# Altium schematic sheet FLASH_BLE.SchDoc
size A; SheetNumber: 4; SheetTotal: 8
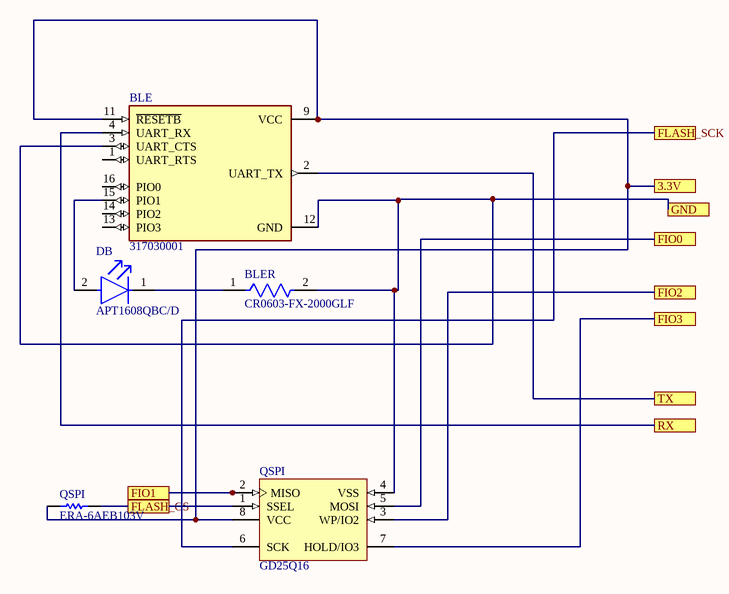
[diagram p0: FLASH_BLE.SchDoc]

## Parts
(Parts that share a designator on the sheet are numbered #1, #2 ... from top to bottom, then left to right.)
BLE  317030001  [XCVR_317030001]
BLER  CR0603-FX-2000GLF  [FP-CR0603-IPC_C]
DB  APT1608QBC/D  [FP-APT1608QBC-D-MFG]
QSPI#1  GD25Q16  [MICT-MN-8_N]
QSPI#2  ERA-6AEB103V  [RESC2013X60X40LL20T25_A]

## Ports
3.3V, FIO0, FIO1, FIO2, FIO3, FLASH_CS, FLASH_SCK, GND, RX, TX

## Nets
3.3V: BLE.9(VCC) BLE.11(~{RESETB}) QSPI#1.8(VCC) QSPI#2.1 ; port 3.3V
FIO0: QSPI#1.5(MOSI) ; port FIO0
FIO1: QSPI#1.2(MISO) ; port FIO1
FIO2: QSPI#1.3(WP/IO2) ; port FIO2
FIO3: QSPI#1.7(HOLD/IO3) ; port FIO3
FLASH_CS: QSPI#1.1(SSEL) QSPI#2.2 ; port FLASH_CS
FLASH_SCK: QSPI#1.6(SCK) ; port FLASH_SCK
GND: BLE.3(UART_CTS) BLE.12(GND) BLER.2 QSPI#1.4(VSS) ; port GND
RX: BLE.4(UART_RX) ; port RX
TX: BLE.2(UART_TX) ; port TX
NetBLE_15: BLE.15(PIO1) DB.2(A)
NetBLER_1: BLER.1 DB.1(C)

Not connected (* = marked no-connect by the designer): BLE 1(UART_RTS) 13(PIO3) 14(PIO2) 16(PIO0)

## Library data of the parts
BLE = 317030001: Bluetooth Bluetooth v4.0 Transceiver Module 2.4GHz Integrated, Trace Surface Mount; MF: Seeed Technology; Value: *; SnapEDA_Link: https://www.snapeda.com/parts/317030001/Seeed%20Technology%20Co.%2C%20Ltd/view-part/449174/?ref=snap; Digi-Key_Purchase_URL: https://www.digikey.kr/product-detail/en/seeed-technology-co-ltd/317030001/1597-1359-ND/5487659?utm_source=snapeda&utm_medium=aggregator&utm_campaign=symbol; MP: 317030001; Digi-Key_Part_Number: 1597-1359-ND; Package: Module Seeed Technology
BLER = CMP-07231-003229-1: Thick Film Chip Resistors 0603 200Ω 0.1W 1% 100ppm/°C; Voltage Rating: 50V; Max Power Dissipation: 100mW; Resistance: 200R; Termination: SMD/SMT; Features: Moisture Resistant; Min Operating Temperature: -55°C; Height: 0.022inch; Depth: 0.8mm; Number of Terminations: 2; Packaging: Tape and Reel; Mount: Surface Mount; Width: 0.8mm; Case/Package: 0603; Max Operating Temperature: 155°C; Composition: Thick Film; Contact Plating: Tin; Length: 1.6mm; Tolerance: 1%; Military Standard: Not; Case Code (Imperial): 0603; Temperature Coefficient: 100ppm/°C; Power Rating: 100mW; Radiation Hardening: No; Case Code (Metric): 1608; Thickness: 457um; Package Quantity: 10000
DB = CMP-2000-05788-2: LED BLUE CLEAR CHIP SMD; Lens Style: Flat; Forward Current: 20mA; Luminous Intensity: 100mcd; Number of LEDs: 1; Dominant Wavelength: 465nm; Lens Color: Colorless; Forward Voltage: 3.3V; Viewing Angle: 120°; Case Code (Imperial): 0603; Number of Pins: 2; Length: 1.6mm; Mount: Surface Mount; Color: Blue; Width: 0.8mm; Height: 0.75mm; Case/Package: 0603; Lead Free: Lead Free; Case Code (Metric): 1608; Lens Transparency: Clear; Min Operating Temperature: -40°C; Packaging: Tape and Reel; Max Operating Temperature: 85°C; Package Quantity: 2000; Test Current: 20mA; Illumination Color: Blue
QSPI#1 = CMP-0357-00068-1: 1 Mb (x1) Serial NOR Flash Memory with Page Erase, 75 MHz, 2.7 to 3.6 V, 8-pin SO8 Narrow (MN), Tube; Part Family: M45PE; Manufacturer: Micron; PartNumber: M45PE10-VMN6P; Speed: 75 MHz; Voltage: 2.7V-3.6V; Density: 1Mb; PackageReference: MICT-MN-8; PackageDescription: 8-Pin SO Narrow, 3.9 X 4.9 mm, Pitch 1.27 mm; Part Status: Production; Mounting Technology: Surface Mount; ComponentLink2Description: Datasheet; ComponentLink1URL: http://www.micron.com/; DatasheetVersion: Rev. 8; ComponentLink1Description: Manufacturer URL; Type: Page Erase; Applications: Embedded; Width: x1; ComponentLink3URL: http://www.micron.com/~/media/Documents/Products/Data%20Sheet/NOR%20Flash/Serial%20NOR/M25P/M25P05A.pdf; RoHS: Yes; ComponentLink2URL: http://www.micron.com/~/media/Documents/Products/Data%20Sheet/NOR%20Flash/Serial%20NOR/M25PE_M45PE/M45PE10.pdf; Package: SO8 Narrow; ComponentLink3Description: Package Specification; PackageVersion: Rev 11
QSPI#2 = CMP-2001-00582-2: Metal Film Chip Resistor, High Reliability Type, 0.125 W, +/- 0.1%, -55 to 155 degC, 0805 (2012 Metric), RoHS, Tape and Reel; Voltage Rating: 100V; Power Rating: 125mW(1/8W); Brand: Panasonic; Temperature Coefficient: 25PPM/C; Resistance: 10kOhms; Product Category: ThinFilmResistors-SMD; Datasheet Version: 02/2016; Operating Temperature Range: -55Cto+155C; Length: 2mm; Mounting Technology: SurfaceMount; Manufacturer URL: http://www.panasonic.com/; Width: 1.25mm; Packaging: Reel; Product: ThinFilmResistorsSMD; Package / Case: 0805(2012metric); Termination Style: SMD/SMT; Tolerance: 0.1%; Datasheet URL: https://industrial.panasonic.com/cdbs/www-data/pdf/RDM0000/AOA0000C307.pdf; Package Description: 2-Pin Surface Mount Device, Body 2 x 1.25 mm; Factory Pack Quantity: 5000; Series: ERA-6A; Case Code - mm: 2012; RoHS: Details; Package Reference: 0805; Height: 0.5mm; Manufacturer: Panasonic; Case Code - in: 0805; Type: MetalFilmChipResistors